# EAGLE design LZ1 (EAGLE 6.1)
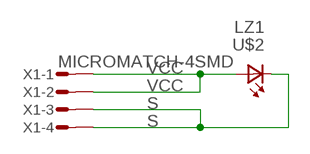
[diagram p0: schematic, sheet 1]

## Parts
U$2  LZ1  [LZ1]
X1  MICROMATCH-4SMD  [MICROMATCH-4SMD]

## Nets
S: U$2.1(C-) U$2.4(C-) X1.3 X1.4
VCC: U$2.2(A+) U$2.3(A+) U$2.5(A+) X1.1 X1.2

## Library data of the parts
U$2 = Power_Led:LZ1
X1 = Con-amp-micromatch (2):MICROMATCH-4: MicroMaTch 4 7-215464-4 / 0-215464-4 Drawing Number C-215464 DDEController.pdf

## Board
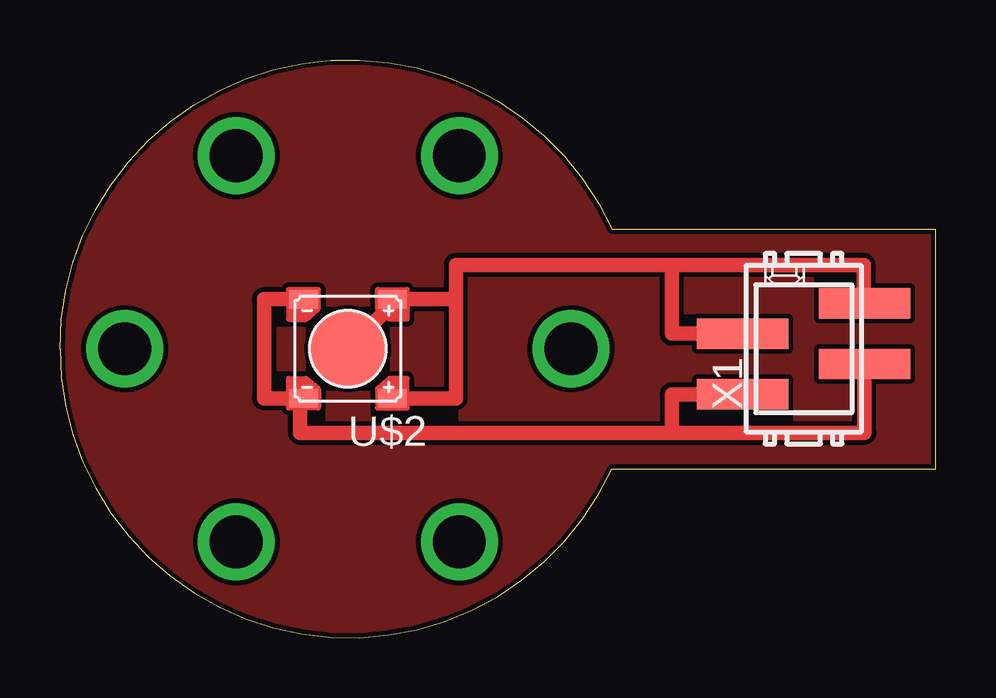
[diagram p1: board, top side]

Size 36.5 x 24.08 mm. Coordinates in mm from the lower left corner, seen from the top.
Outline: 23,17.04 36.5,17.04 36.5,7.04 23,7.04 arc-156 0,12.04 arc-156 23,17.04
Copper layers (1*16): Top 0.035mm / dielectric 1.5mm / Bottom 0.035mm
Design rules: minimum track width 10mil, minimum drill 24mil, track to track 0.15mm, track to pad 8mil, pad to pad 8mil, via to via 8mil, smd to smd 8mil, copper to edge 0.2mm, drill to drill 8mil, minimum pad ring 10mil, minimum via ring 8mil, stop-mask expansion 4mil, vias tented up to drill 0mil, thermal gap 10mil

### Footprints (pad centres in the part's own frame; a part is rotated, then mirrored left to right if it is on the bottom)
LZ1 = smd 1.2 x 0.77: 1 -1.85,2.07; 2 1.85,2.07; 3 1.85,-2.07; 4 -1.85,-2.07 | smd 3.2 x 3.2: 5 0,0
MICROMATCH-4SMD = smd 1.27 x 3.81: 1 1.905,-2.54; 2 0.635,2.54; 3 -0.635,-2.54; 4 -1.905,2.54

### Placement (x,y rotation side)
U$2  12,12.04 0 top
X1  31,12.04 90 top

### Tracks (layer width: path | path; a pad name or v marks a point on that pad's centre or on a via)
GND
  pour Top (isolate 0.2, no thermals): 0,12.04 arc-90 12,24.04 arc-65 23,17.04 36.5,17.04 36.5,7.04 23,7.04 arc-65 12,0.04 arc-90
N$1  (via drill 2.2)
  other vias: 2.7,12.04
N$2  (via drill 2.2)
  other vias: 16.65,20.1
N$3  (via drill 2.2)
  other vias: 7.35,20.1
N$6  (via drill 2.2)
  other vias: 21.3,12.04
N$7  (via drill 2.2)
  other vias: 7.35,3.99
N$8  (via drill 2.2)
  other vias: 16.65,3.99
S  (1 unrouted)
  Top 0.61: 25.5,8.54 10,8.54 10,10.04 | 25.5,8.54 33.54,8.54 X1.3 | X1.4 25.5,10.14 25.5,8.54 | U$2.4 8.5,9.97 8.5,14.11 U$2.1
VCC
  Top 0.61: X1.2 25.5,12.68 25.5,15.54 | 16.5,14.11 U$2.2 13.85,13.89 U$2.5 | 16.5,14.11 16.5,15.54 25.5,15.54 | X1.1 33.5,13.95 33.5,15.54 25.5,15.54 | U$2.3 16.5,9.97 16.5,14.11